# Altium schematic sheet Single_12V.SchDoc
size A4
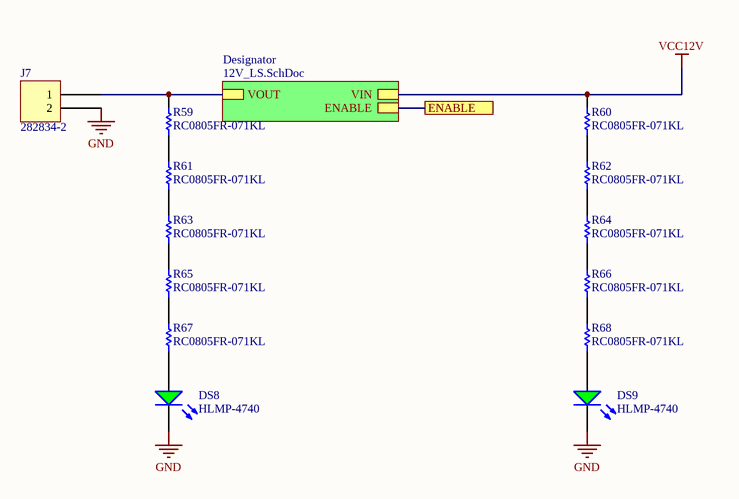
[diagram p0: Single_12V.SchDoc]

## Parts
DS8  HLMP-4740  [AVAG-HLMP-4740]
DS9  HLMP-4740  [AVAG-HLMP-4740]
J7  282834-2  [TE 282834-2]
R59  RC0805FR-071KL  [RESC2013X60X35ML10T20]
R60  RC0805FR-071KL  [RESC2013X60X35ML10T20]
R61  RC0805FR-071KL  [RESC2013X60X35ML10T20]
R62  RC0805FR-071KL  [RESC2013X60X35ML10T20]
R63  RC0805FR-071KL  [RESC2013X60X35ML10T20]
R64  RC0805FR-071KL  [RESC2013X60X35ML10T20]
R65  RC0805FR-071KL  [RESC2013X60X35ML10T20]
R66  RC0805FR-071KL  [RESC2013X60X35ML10T20]
R67  RC0805FR-071KL  [RESC2013X60X35ML10T20]
R68  RC0805FR-071KL  [RESC2013X60X35ML10T20]

## Sub-sheets
Designator = 12V_LS.SchDoc: VIN, VOUT, ENABLE

## Ports
ENABLE

## Nets
GND: DS8.2(K) DS9.2(K) J7.2
VCC12V: R60.2 ; sheet Designator/VIN
ENABLE: port ENABLE, sheet Designator/ENABLE
NetDS8_1: DS8.1(A) R67.1
NetDS9_1: DS9.1(A) R68.1
NetJ7_1: J7.1 R59.2 ; sheet Designator/VOUT
NetR59_1: R59.1 R61.2
NetR60_1: R60.1 R62.2
NetR61_1: R61.1 R63.2
NetR62_1: R62.1 R64.2
NetR63_1: R63.1 R65.2
NetR64_1: R64.1 R66.2
NetR65_1: R65.1 R67.2
NetR66_1: R66.1 R68.2

## Library data of the parts
DS8 DS9 = CMP-2000-06413-1: T-1 3/4 (5 mm) Low Current LED Lamp, Green, 1.9 V, -20 to 100 degC, 2-Pin THD, RoHS, Bulk; Manufacturer: AvagoTechnologies; Type: Uni-Color; Peak Wavelength: 565nm; Rad Hard: No; Viewing Angle: 50°; Dominant Wavelength/Color Temperature: 569nm; Number of LEDs: 1; Lens Appearance: ColoredDiffused; Lens Shape Type: Circular; Mounting Orientation: TopMount; Intensity: 2.3mcd; Datasheet Version: 07/2014; Category: LEDs; Datasheet URL: http://docs.avagotech.com/docs/AV02-1557EN; Packaging: Bulk; Pin Count: 2; Mounting Technology: ThroughHole; Package Reference: HLMP-4740; Mounting: ThroughHole; Manufacturer URL: http://www.avagotech.com/; Color: Green; Package: 2T-13/4; Package Description: 2-Pin Through Hole Device, Dia 5.845 mm, Pitch 2.54 mm
J7 = 282834-2: TERM BLK 2P SIDE ENT 2.54MM PCB; Manufacturer: TE Connectivity AMP Connectors; Current: 10A; Mating Orientation: Horizontal with Board; Number of Levels: 1; Pitch: 0.100" (2.54mm); Positions Per Level: 2; Voltage: 150V; Wire Gauge: 16-30 AWG; Wire Termination: Screw - Rising Cage Clamp; Part Number: 282834-2; Color: Green; ComponentLink1Description: Datasheet; ComponentLink1URL: https://www.te.com/commerce/DocumentDelivery/DDEController?Action=srchrtrv&DocNm=282834&DocType=Customer+Drawing&DocLang=English; ComponentLink2Description: DigiKey Link; ComponentLink2URL: http://digikey.com/product-detail/en/te-connectivity-amp-connectors/282834-2/A98333-ND/1150135; LastUpdated: 2020-01-15 4:15:38 AM; Lifecycle Status: Active; Minimum Order: 1; Mounting Type: Through Hole; Packaging: Bulk; Part Status: Active; Price: 0.88; Series: Buchanan; Supplier 1: DigiKey; Supplier Part Number 1: A98333-ND
R59-R68 = CMP-2100-03671-1: Chip Resistor, 1 KOhm, +/- 1%, 125 mW, -55 to 155 degC, 0805 (2012 Metric), RoHS, Tape and Reel; Manufacturer: Yageo; Temperature Coefficient: 100ppm/degreesC; Voltage Rating (DC): 150V; Max Power Dissipation: 125mW; Resistance: 1KOhm; Number of Pins: 2; Number of Terminations: 2; Datasheet URL: http://www.yageo.com/NewPortal/yageodocoutput?fileName=/pdf/R-Chip/PYu-RC_Group_51_RoHS_L_5.pdf; Length: 0.079inch; Package Description: 2-Pin Surface Mounted Device, Body 2 x 1.25 mm; Depth: 1.25mm; Height: 0.024inch; Military Standard: Not; Case/Package: 0805; Package Reference: 0805; RoHSCompliant: true; Lead Free: LeadFree; Packaging: TapeandReel; Package Quantity: 1; Datasheet Version: Rev. 5, 10/2016; Tolerance: 1%; Min Operating Temperature: -55degC; Voltage Rating: 150V; Composition: ThickFilm; Case Code (Imperial): 0805; Power Rating: 125mW; Width: 0.049inch; Case Code (Metric): 2012; Manufacturer URL: http://www.yageo.com/; Max Operating Temperature: 155degC; REACH SVHC: Unknown; Termination: SMD/SMT